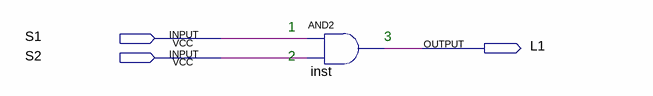
[diagram p0: schematic sheet]
// Quartus schematic Voltage_Diagram.bdf as structural Verilog: 1 symbols, 3 pins
module Voltage_Diagram (
  input  S1,
  input  S2,
  output L1
);

  and inst (L1, S1, S2);

  // Notes on the sheet:
  //   1
  //   3
  //   2
endmodule
